# EAGLE design Adafruit Feather RP4020 rev B (EAGLE 9.6.2)
COMPANY: ADAFRUIT INDUSTRIES; DRAWN: KTOWN; REV: B
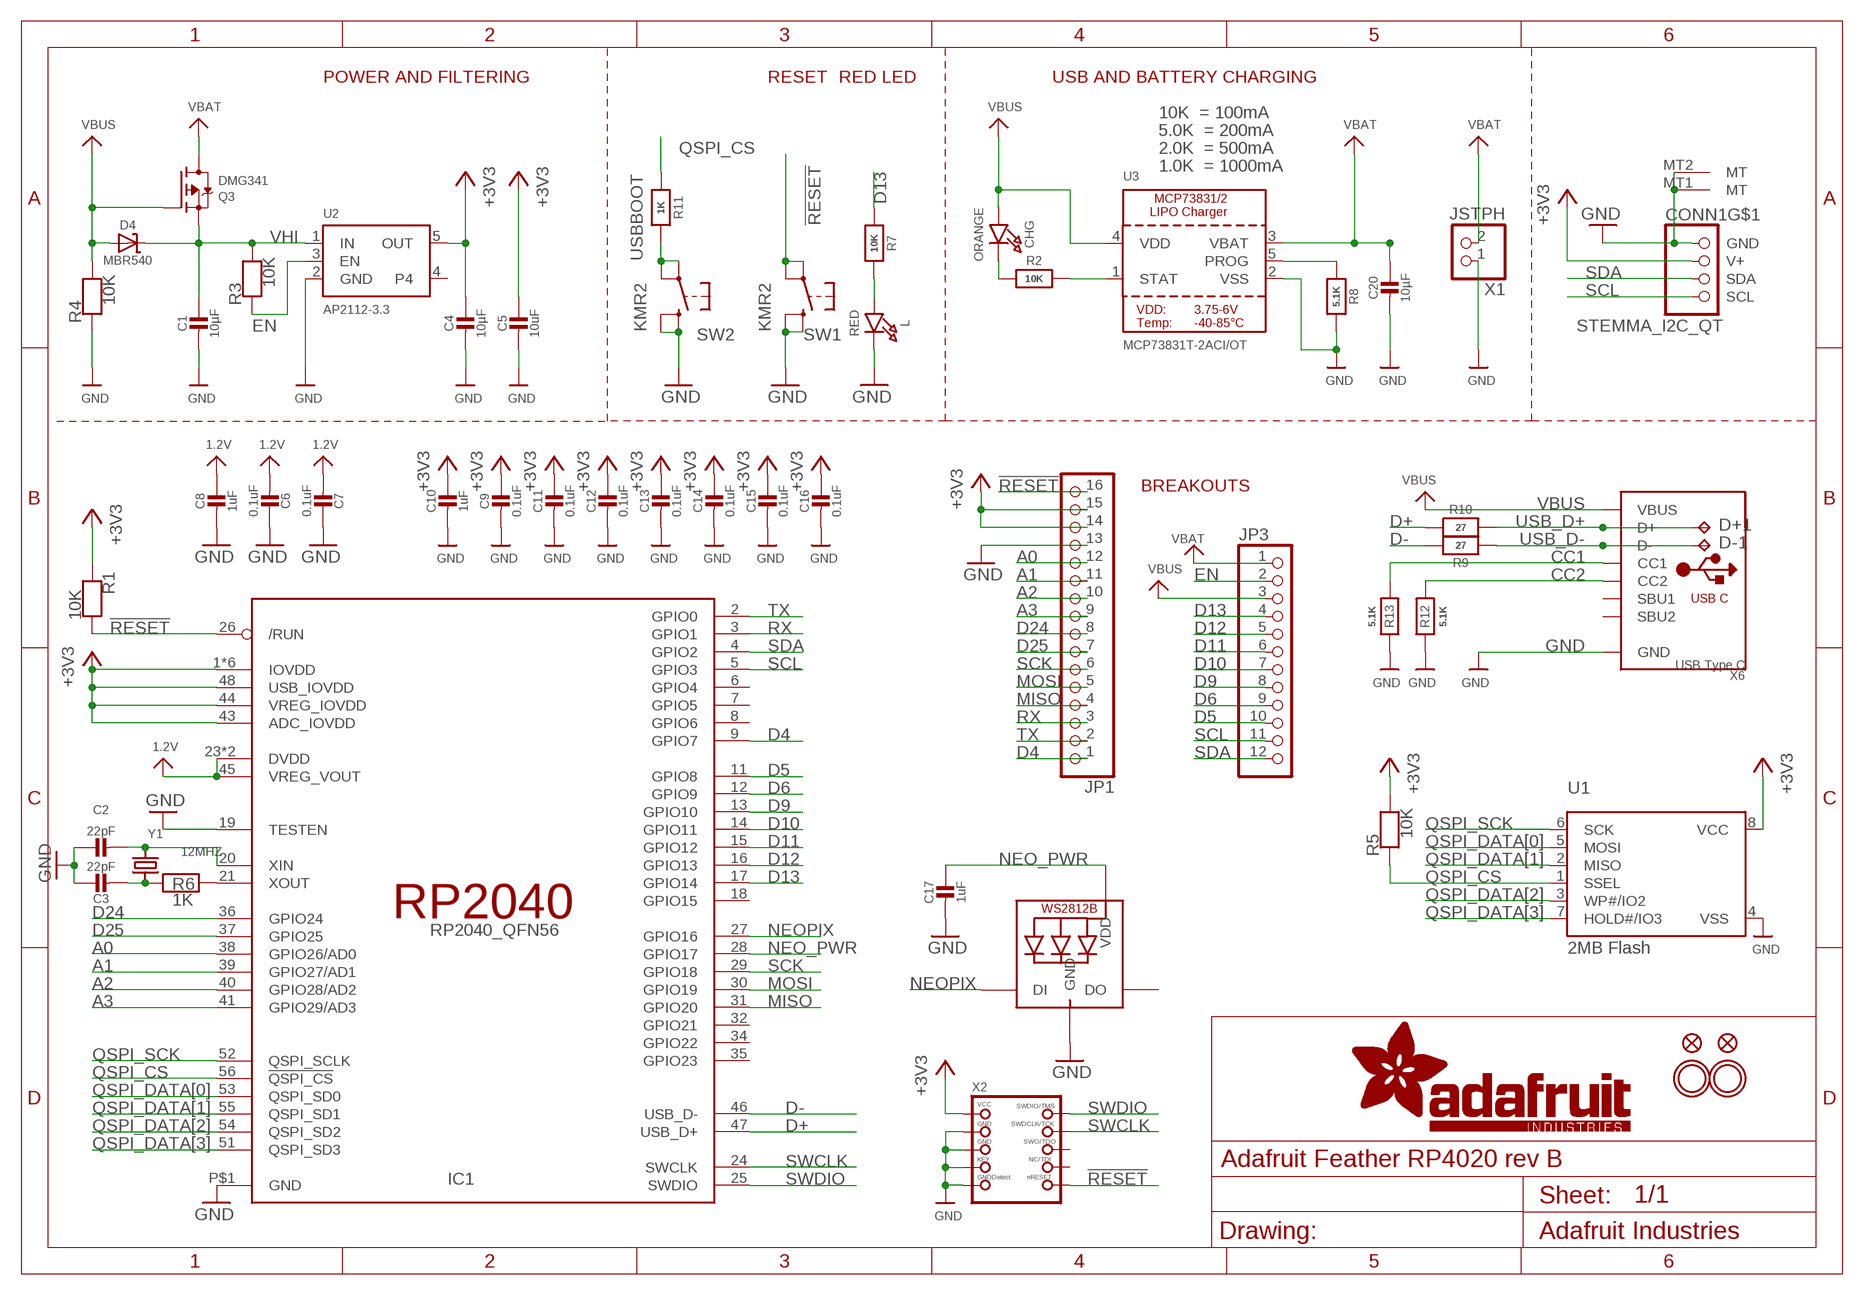
[diagram p0: schematic, sheet 1]

## Parts
C1  10µF  CAP_CERAMIC0805-NOOUTLINE  [0805-NO]
C2  22pF  CAP_CERAMIC0603_NO  [0603-NO]
C3  22pF  CAP_CERAMIC0603_NO  [0603-NO]
C4  10µF  CAP_CERAMIC0805-NOOUTLINE  [0805-NO]
C5  10uF  CAP_CERAMIC0805-NOOUTLINE  [0805-NO]
C6  0.1uF  CAP_CERAMIC0603_NO  [0603-NO]
C7  0.1uF  CAP_CERAMIC0603_NO  [0603-NO]
C8  1uF  CAP_CERAMIC0603_NO  [0603-NO]
C9  0.1uF  CAP_CERAMIC0603_NO  [0603-NO]
C10  1uF  CAP_CERAMIC0603_NO  [0603-NO]
C11  0.1uF  CAP_CERAMIC0603_NO  [0603-NO]
C12  0.1uF  CAP_CERAMIC0603_NO  [0603-NO]
C13  0.1uF  CAP_CERAMIC0603_NO  [0603-NO]
C14  0.1uF  CAP_CERAMIC0603_NO  [0603-NO]
C15  0.1uF  CAP_CERAMIC0603_NO  [0603-NO]
C16  0.1uF  CAP_CERAMIC0603_NO  [0603-NO]
C17  1uF  CAP_CERAMIC0603_NO  [0603-NO]
C20  10µF  CAP_CERAMIC0805-NOOUTLINE  [0805-NO]
CHG  ORANGE  LED0603_NOOUTLINE  [CHIPLED_0603_NOOUTLINE]
CONN1  STEMMA_I2C_QT  [JST_SH4]
D4  MBR540  DIODE-SCHOTTKYSOD-123  [SOD-123]
D+1  TPB1,27  [B1,27]
D-1  TPB1,27  [B1,27]
IC1  RP2040_QFN56  [QFN56_7MM_REDUCEDEPAD]
JP1  HEADER-1X16ROUND  [1X16_ROUND]
JP3  HEADER-1X12  [1X12_ROUND]
L  RED  LED0603_NOOUTLINE  [CHIPLED_0603_NOOUTLINE]
LED1  WS2812B3535  [LED3535]
Q3  DMG341  MOSFET-P  [SOT23-R]
R1  10K  RESISTOR_0603_NOOUT  [0603-NO]
R2  10K  RESISTOR_0603_NOOUT  [0603-NO]
R3  10K  RESISTOR_0603_NOOUT  [0603-NO]
R4  10K  RESISTOR_0603_NOOUT  [0603-NO]
R5  10K  RESISTOR_0603_NOOUT  [0603-NO]
R6  1K  RESISTOR_0603_NOOUT  [0603-NO]
R7  10K  RESISTOR_0603_NOOUT  [0603-NO]
R8  5.1K  RESISTOR_0603_NOOUT  [0603-NO]
R9  27  RESISTOR_0603_NOOUT  [0603-NO]
R10  27  RESISTOR_0603_NOOUT  [0603-NO]
R11  1K  RESISTOR_0603_NOOUT  [0603-NO]
R12  5.1K  RESISTOR_0603_NOOUT  [0603-NO]
R13  5.1K  RESISTOR_0603_NOOUT  [0603-NO]
SW1  KMR2  SWITCH_TACT_SMT4.6X2.8  [BTN_KMR2_4.6X2.8]
SW2  KMR2  SWITCH_TACT_SMT4.6X2.8  [BTN_KMR2_4.6X2.8]
U1  2MB Flash  SPIFLASH_8PIN208MIL  [SOIC8_208MIL]
U2  AP2112-3.3  VREG_SOT23-5  [SOT23-5@1]
U3  MCP73831T-2ACI/OT  MCP73831/2  [SOT23-5]
U$31  MOUNTINGHOLE2.5  [MOUNTINGHOLE_2.5_PLATED]
U$32  MOUNTINGHOLE2.5  [MOUNTINGHOLE_2.5_PLATED]
U$34  FIDUCIAL_1MM  [FIDUCIAL_1MM]
U$35  FIDUCIAL_1MM  [FIDUCIAL_1MM]
X1  JSTPH  CON_JST_PH_2PIN_BATT  [JSTPH2_BATT]
X2  JTAG-CORTEXBOXPOSTS  [2X05_1.27MM_BOX_POSTS]
X6  USB Type C  USB_C  [USB_C_CUSB31-CFM2AX-01-X]
Y1  12MHZ  CRYSTAL2.5X2.0  [CRYSTAL_2.5X2]

## Nets
1.2V: C6.2 C7.2 C8.1 IC1.23(DVDD) IC1.45(VREG_VOUT) IC1.50(DVDD)
!RESET: IC1.26(/RUN) JP1.16 R1.2 SW1.A'(P1) SW1.A(P) X2.10(NRESET)
+3V3: C4.1 C5.1 C9.1 C10.1 C11.1 C12.1 C13.1 C14.1 C15.1 C16.1 CONN1.2(V+) IC1.1(IOVDD) IC1.10(IOVDD) IC1.22(IOVDD) IC1.33(IOVDD) IC1.42(IOVDD) IC1.43(ADC_IOVDD) IC1.44(VREG_IOVDD) IC1.48(USB_IOVDD) IC1.49(IOVDD) JP1.14 JP1.15 R1.1 R5.2 U1.8(VCC) U2.5(OUT) X2.1(VCC)
A0: IC1.38(GPIO26/AD0) JP1.12
A1: IC1.39(GPIO27/AD1) JP1.11
A2: IC1.40(GPIO28/AD2) JP1.10
A3: IC1.41(GPIO29/AD3) JP1.9
CC1: R13.2 X6.A5(CC1)
CC2: R12.2 X6.B5(CC2)
D4: IC1.9(GPIO7) JP1.1
D5: IC1.11(GPIO8) JP3.10
D6: IC1.12(GPIO9) JP3.9
D9: IC1.13(GPIO10) JP3.8
D10: IC1.14(GPIO11) JP3.7
D11: IC1.15(GPIO12) JP3.6
D12: IC1.16(GPIO13) JP3.5
D13: IC1.17(GPIO14) JP3.4 R7.1
D24: IC1.36(GPIO24) JP1.8
D25: IC1.37(GPIO25) JP1.7
D+: IC1.47(USB_D+) R10.2
D-: IC1.46(USB_D-) R9.2
EN: JP3.2 R3.1 U2.3(EN)
GND [power]: C1.2 C2.1 C3.1 C4.2 C5.2 C6.1 C7.1 C8.2 C9.2 C10.2 C11.2 C12.2 C13.2 C14.2 C15.2 C16.2 C17.2 C20.2 CONN1.1(GND) CONN1.MT1(MT) CONN1.MT2(MT) IC1.19(TESTEN) IC1.P$1(GND) JP1.13 L.C LED1.4(GND) R4.1 R8.2 R12.1 R13.1 SW1.B'(S1) SW1.B(S) SW2.B'(S1) SW2.B(S) U1.4(VSS) U2.2(GND) U3.2(VSS) X1.1 X2.3(GND) X2.5(GND) X2.7(KEY) X2.9(GNDDETECT) X6.A1B12(GND) X6.B1A12(GND)
MISO: IC1.31(GPIO20) JP1.4
MOSI: IC1.30(GPIO19) JP1.5
N$1: CHG.C R2.1
N$2: L.A R7.2
N$3: R2.2 U3.1(STAT)
N$4: R8.1 U3.5(PROG)
N$5: C2.2 IC1.20(XIN) Y1.3
N$6: C3.2 R6.1 Y1.1
N$7: IC1.21(XOUT) R6.2
NEO_PWR: C17.1 IC1.28(GPIO17) LED1.2(VDD)
NEOPIX: IC1.27(GPIO16) LED1.1(DI)
QSPI_CS: IC1.56(!QSPI_CS) R5.1 R11.1 U1.1(SSEL)
QSPI_DATA[0]: IC1.53(QSPI_SD0) U1.5(MOSI)
QSPI_DATA[1]: IC1.55(QSPI_SD1) U1.2(MISO)
QSPI_DATA[2]: IC1.54(QSPI_SD2) U1.3(WP#/IO2)
QSPI_DATA[3]: IC1.51(QSPI_SD3) U1.7(HOLD#/IO3)
QSPI_SCK: IC1.52(QSPI_SCLK) U1.6(SCK)
RX: IC1.3(GPIO1) JP1.3
SCK: IC1.29(GPIO18) JP1.6
SCL: CONN1.4(SCL) IC1.5(GPIO3) JP3.11
SDA: CONN1.3(SDA) IC1.4(GPIO2) JP3.12
SWCLK: IC1.24(SWCLK) X2.4(SWDCLK)
SWDIO: IC1.25(SWDIO) X2.2(SWDIO)
TX: IC1.2(GPIO0) JP1.2
USB_D+: D+1.TP R10.1 X6.A6(D+) X6.B6(D+)
USB_D-: D-1.TP R9.1 X6.A7(D-) X6.B7(D-)
USBBOOT: R11.2 SW2.A'(P1) SW2.A(P)
VBAT [power]: C20.1 JP3.1 Q3.3(D) U3.3(VBAT) X1.2
VBUS [power]: CHG.A D4.A JP3.3 Q3.1(G) R4.2 U3.4(VDD) X6.A4B9(VBUS) X6.B4A9(VBUS)
VHI [power]: C1.1 D4.C Q3.2(S) R3.2 U2.1(IN)
Unconnected: IC1.6(GPIO4) IC1.7(GPIO5) IC1.8(GPIO6) IC1.18(GPIO15) IC1.32(GPIO21) IC1.34(GPIO22) IC1.35(GPIO23) LED1.3(DO) U2.4 X2.6(SWO) X2.8(TDI) X6.A8(SBU1) X6.B8(SBU2)

## Notes on the sheet
- POWER AND FILTERING | RESET | RED LED | USB AND BATTERY CHARGING
- 10K  = 100mA
- 5.0K  = 200mA
- 2.0K  = 500mA
- 1.0K  = 1000mA
- BREAKOUTS

## Library data of the parts
C1-C3 C5-C17 C20 = microbuilder:CAP_CERAMIC: Ceramic Capacitors For new designs, use the packages preceded by an '_' character since they are more reliable: The following footprints should be used on most boards: _0402 - Standard footprint for regular board layouts _0603 - Standard footprint for regular board layouts _0805 - Standard footprint for regular board layouts _1206 - Standard footprint for regular board layouts For extremely tight-pitch boards where space is at a premium, the following 'micro-pitch' footprints can be used (smaller pads, no silkscreen outline, etc.): _0402MP - Micro-pitch footprint for very dense/compact boards _0603MP - Micro-pitch footprint for very dense/compact boards _0805MP - Micro-pitch footprint for very dense/compact boards _1206MP - Micro-pitch footprint for very dense/compact boards
C4 = microbuilder:CAP_CERAMIC: Ceramic Capacitors For new designs, use the packages preceded by an '_' character since they are more reliable: The following footprints should be used on most boards: _0402 - Standard footprint for regular board layouts _0603 - Standard footprint for regular board layouts _0805 - Standard footprint for regular board layouts _1206 - Standard footprint for regular board layouts For extremely tight-pitch boards where space is at a premium, the following 'micro-pitch' footprints can be used (smaller pads, no silkscreen outline, etc.): _0402MP - Micro-pitch footprint for very dense/compact boards _0603MP - Micro-pitch footprint for very dense/compact boards _0805MP - Micro-pitch footprint for very dense/compact boards _1206MP - Micro-pitch footprint for very dense/compact boards; REV: A
CHG L = microbuilder:LED: LED 0603 - 0603 Surface Mount Package 2mA: Green LED - Low Power (3.9mcd, 2ma, 1.7Vf) - Digikey: 475-2709-2-ND Orange LED - Low Power (9.8mcd, 2ma, 1.8Vf) - Digikey: 475-1194-2-ND Red LED - Low Power (5mcd, 2ma, 1.8Vf) - Digikey: 475-1195-2-ND Yellow LED - Low Power (7mcd, 2ma, 1.8Vf) - Digikey: 475-1196-2-ND 5mA: Blue LED - Low Power (17mcd, 5ma, 2.9Vf) - Digikey: LNJ937W8CRACT-ND 0805 - 0805 Surface Mount Package 2mA: Red LED (8.8mcd, 2mA, 1.8Vf, Clear) - Low Power [Digikey: 475-2510-1-ND] Green LED (5mcd, 2mA, 1.8Vf, Clear) - Low Power [Digikey: 475-2730-1-ND] Yellow LED (11.3mcd, 2mA, 1.8Vf, Clear) - Low Power [Digikey: 475-2555-1-ND] 20mA: Red LED (104mcd, 20mA, Diffused) - LS R976 [Digikey: 475-1278-6-ND] Red LED (12mcd, 20mA, 2.0Vf, Clear) - APT2012EC [Digikey: 754-1128-1-ND] Green LED (15mcd, 20mA, 2.2Vf, Clear) - APT2012GC [Digikey: 754-1131-1-ND] Orange LED (160mcd, 20mA, 2.1Vf, Clear) - APT2012SECK [Digikey: 754-1130-1-ND] 1206 - 1206 Surface Mount Package Green LED (26mcd, 20mA, Diffused) - LG N971 [Digikey: 475-1407-6-ND] Red LED (15mcd, 20mA, Diffused) - LH N974 [Digikey: 475-1416-6-ND] Cree - Cree High-Power Surface Mount LEDs XPEBWT-L1-0000-00D50 - White 111lm 350mA 2.9Vf 6200K 110° XTEAWT-00-0000-00000LEE3 - White 114lm 350mA 2.85Vf 5000K 115° Everlight - Everlight 45-21 Series Surface Mount LEDs 45-21/QK2C-B2832AC2CB2/2T - Warm White 2000mcd 20mA 3.25Vf 3050K 120° 45-21/LK2C-B38452C4CB2/2T - Nuetral White 2000mcd 20mA 3.25Vf 4150K 120° 45-21/LK2C-B50634C6CB2/2T - Cold White 2200mcd 20mA 3.25Vf 5650K 120° PLCC2 Reverse Mount LS T77K-J1L2-1-0-2-R18-Z - Red 11.25mcd 2mA 1.8Vf 630nm 120° LO T77K-L1M2-24-Z - Orange 19.6mcd 2mA 1.8Vf 606nm 120° LY T77K-K2M1-26-Z - Yellow 15.7mcd 2mA 1.8Vf 587nm 120°
CONN1 = microbuilder:STEMMA_I2C
D4 = microbuilder:DIODE-SCHOTTKY
D+1 D-1 = testpad:TP: Test pad
IC1 = adafruit_micro:RP2040
JP1 = microbuilder:HEADER-1X16: PIN HEADER
JP3 = microbuilder:HEADER-1X12
LED1 = microbuilder:WS2812B
Q3 = microbuilder:MOSFET-P: P-Channel Mosfet LEGEND VDS: Voltage Drain-Source ID: Drain Current RDS(ON): Drain-Source On-State Resistance VGS(TH): Gate-Source Threshold Voltage CISS: Drain-Source Input Capacitance SOT-23 Name VDS ID RDS(ON) VGS(TH) CISS Order Number IRLML5103 30V 760mA 600 mOhm -- 75pF @ 25V Digikey: IRLML5103PBFCT-ND IRLML6401 12V 4.3A 50 mOhm 950mV @ 250µA 830pF @ 10V Digikey: IRLML6401PBFTR-ND NTR0202PL 20V 400mA 800 mOhm 2.3V @ 250uA 70pF @ 5V Digikey: NTR0202PLT1GOSTR-ND NTR4101PT1G 20V 1.8A 85 mOhm 1.2V @ 250uA 675pF @ 10V Digikey: NTR4101PT1GOSCT-ND DMP2004K 20V 600mA 900 mOhm 1V @ 250uA 175pF @ 16V Digikey: DMP2004KDICT-ND PMV65XP 20V 3.9A 76 mOhm 950mV @ 1mA 725pF @ 20V Digikey: 568-2358-2-ND TO-252 Name VDS ID RDS(ON) VGS(TH) CISS Order Number AOD417 30V 25A 34 mOhm 3V @ 250µA 920pF @ 15V Digikey: 785-1106-2-ND PowerPak Name VDS ID RDS(ON) VGS(TH) CISS Order Number AON7401 30V 12A 14 mOhm 3V @ 250µA 2600pF @ 15V Digikey: 785-1302-1-ND
R1-R13 = microbuilder:RESISTOR: Resistors For new designs, use the packages preceded by an '_' character since they are more reliable: The following footprints should be used on most boards: _0402 - Standard footprint for regular board layouts _0603 - Standard footprint for regular board layouts _0805 - Standard footprint for regular board layouts _1206 - Standard footprint for regular board layouts For extremely tight-pitch boards where space is at a premium, the following 'micro-pitch' footprints can be used (smaller pads, no silkscreen outline, etc.): _0402MP - Micro-pitch footprint for very dense/compact boards _0603MP - Micro-pitch footprint for very dense/compact boards _0805MP - Micro-pitch footprint for very dense/compact boards _1206MP - Micro-pitch footprint for very dense/compact boards
SW1 SW2 = microbuilder:SWITCH_TACT_SMT: SMT Tact Switches 6x6mm - Digikey: P12940SCT-ND KMR2 (4.6x2.8mm) - Digikey: 401-1426-1-ND EVQ-PQHB55 - Light Touch, 160GF (4.5x4.5mm) - Digikey: P8090SCT-ND KMT0 - KMT021 NGJ LHS (etc.) IP68/Waterproof - Digikey: CKN10289CT-ND
U1 = microbuilder:SPIFLASH_8PIN: SOIC8 SPI Flash Be careful with the size since SOIC8 flash comes in several 'widths' SOIC8 150 mil M25P16 - 16Mbit (2Mbit x 8) Serial Flash (75MHz SPI Bus), Supply: 2.7-3.6V Digikey: SOIC8 - M25P16-VMN6P-ND SOIC8 208 mil W25Q16BVSSIG - 16Mbit (2Mbit x 8) Serial Flash (104MHz SPI Bus), Supply: 2.7-3.6V Digikey: SOIC8 - W25Q16BVSSIG-ND
U2 = microbuilder:VREG_SOT23-5: SOT23-5 Fixed Voltage Regulators Part Current Out V Out V In V Dropout θJA (°C/W) TJ (°C) Digikey Part No. ADP121 150mA 3.3V 3.4-5.5V 0.09V @ 150mA -- -- ADP121-AUJZ33R7CT-ND ADP121 150mA 3.0V 3.1-5.5V 0.09V @ 150mA -- -- ADP121-AUJZ30R7CT-ND ADP122 300mA 3.3V 3.4-5.5V 0.085V @ 300mA -- -- ADP122AUJZ-3.3-R7CT-ND ADP1712 300mA 3.3V 3.5-5.5V 0.17V @ 300mA -- -- ADP1712AUJZ-3.3-R7TR-ND AP7311 (Low Cost) 150mA 3.3V 3.5-6V 0.15V @ 150mA -- -- AP7311-33WG-7DICT-ND LD39015M18R 150mA 1.8V 1.9V-5.5V 0.08V @ 100mA -- -- 497-6977-1-ND LP2985A-33DBVR 150mA 3.3V 3.3-16V 0.28V @ 150mA 206 150 296-18479-1-ND MCP1824T-3302E/OT 300mA 3.3V 3.5V-6V 0.2V @ 300mA -- -- MCP1824T-3302E/OTCT-ND MIC5205-2.5YM5 TR 150mA 2.5V 2.7-16V 0.165V @ 150mA -- -- 576-1257-2-ND MIC5205-3.0YM5 TR 150mA 3.0V 3.2V-16V 0.165V @ 150mA -- -- 576-1258-2-ND MIC5205-3.3YM5 TR 150mA 3.3V 3.5V-16V 0.165V @ 150mA -- -- 576-1259-2-ND TPS780330220 150mA 3.3V+2.2V 3.6-5.5V 250mV Max -- -- 296-23332-1-ND TDA3663/N1,135 100mA 3.3V 3.5-45V 0.18V @ 50mA -- -- 568-5343-1-ND Max operating temp can be calculated using θJA, TJ (max junction temperature), and power in watts. Set the "Maximum Ambient Temperature" until it reaches TJ ("Max Junction Temperature"), which is the absolute limit for safe use of the regulator: Heat Sink Temperature Calculator <http://www.daycounter.com/Calculators/Heat-Sink-Temperature-Calculator.phtml> For example, With 12V source into a 3.3V LP2985 and a 30mA load, we are dissipating (12V-3.3V) * 0.03A = 0.261W. With a θJA of 206 °C/W, a TJ of 150°C, and 261mW we can safely use the chip without a heat sink up to 75°C (=147.1°C Junction Temperature).
U3 = microbuilder:MCP73831/2: MCP73831/2 LIPO Charger VDD: 3.75 - 6V Temp -40 - 85°C Programmable Charge Rate: 15-500mA NOTE: STAT is a tri-state logic output on the MCP73831 and an open-drain output on the MCP73832. SOT23-5 with 4.2V output and tri-state logic on STAT = MCP73831T-2ACI/OT
U$31 U$32 = microbuilder:MOUNTINGHOLE: Mounting Hole For #2 screws (0.086"/2.18mm width, 0.094"/2.4mm hole) use 2.5mm; BOM: EXCLUDE
U$34 U$35 = microbuilder:FIDUCIAL: Fiducial Alignment Points Various fiducial points for machine vision alignment.; BOM: EXCLUDE
X1 = microbuilder:CON_JST_PH_2PIN: JST 2-Pin Right-Angle Connector PH-Series - 4UConnector: 17311 SH-Series - 4UConnector: 07278
X2 = microbuilder:JTAG-CORTEX: Serial Wire (SW-DP) Connector Standard 0.05" 10-pin connector is for use with the Cortex M and Cortex A SWD (serial wire debugger) interface (SW-DP) Connectors 2x05_1.27MM_SMT - Inexpensive surface-mount header with bare pins, compatible with standard 10-pin SWD cables (4UCON: 16846) 2x05_1.27MM_BOX_NOPOSTS - Polarised surface-mount box (4UCON with caps: 19735, without caps: 15117 2x05_1.27MM_BOX_POSTS - Polarised surface-mount box with mounting holes (4UCON: 20317) Pinout: http://infocenter.arm.com/help/topic/com.arm.doc.faqs/attached/13634/cortex_debug_connectors.pdf http://www.keil.com/peripherals/coresight/connectors.asp
X6 = microbuilder:USB_C: USB Type-C USB 2.0 Connector
Y1 = microbuilder:CRYSTAL: Crystals HC49UP - Surface Mount Crystal 4.0MHz 18pF +/-30ppm Surface Mount Crystal [Digikey: 535-9857-1-ND] 12.0 MHz Surface Mount Crystal [Digikey: 535-9869-6-ND] 25.0 MHz Surface Mount Crystal [Digikey: 535-9078-1-ND] 2.5 x 2.0mm - MEMs SMT Crystal 16.0 MHz 10pF 20ppm 2.5 x 2.0mm Crystal [Digikey -40-85°C: 535-10923-1-ND] 3.2 x 2.5mm - MEMs SMT Crystal 12.0 MHz 8pF 15ppm 3.2 x 2.5mm Crystal [Digikey: -10-70°C: 644-1047-1-ND -40-125°C: 644-1128-1-ND] 40~85°C cheaper: 644-1173-6-ND 16.0 MHz 8pF 15ppm 3.2 x 2.5mm Crystal [Digikey: -10-70°C: 644-1049-1-ND -40-125°C: 644-1129-2-ND]-40~85°C cheaper: 644-1175-6-ND 16.0 MHz 10pF 10ppm 3.2 x 2.5mm Crystal [Digikey: 644-1100-1-ND] 27.12 MHz 18pF 30ppm 3.2 x 2.5mm Crystal [Digikey: 887-1424-1-ND] 27.12MHz 10pF 10ppm 3.2 x 2.5mm Crystal [Digikey: 887-1329-1-ND] 4.9 x 1.8mm - MEMs SMT Crystal 32.768 KHz 12.5pF 20ppm 4.9 x 1.8mm Crystal [Digikey: SE2415CT-ND] 8.0 x 3.8mm - Surface Mount Crystal 32.768kHz 12.5pF 20ppm -40°C-85°C [Digikey: 535-9166-2-ND] Cylinder 32.768KHz Cylinder Crystal (2x6mm body) [Ex. Digikey: 300-8341-2-ND]

## Net classes
1 power: width 0.305 mm
2 gnd: width 0.254 mm

## Board
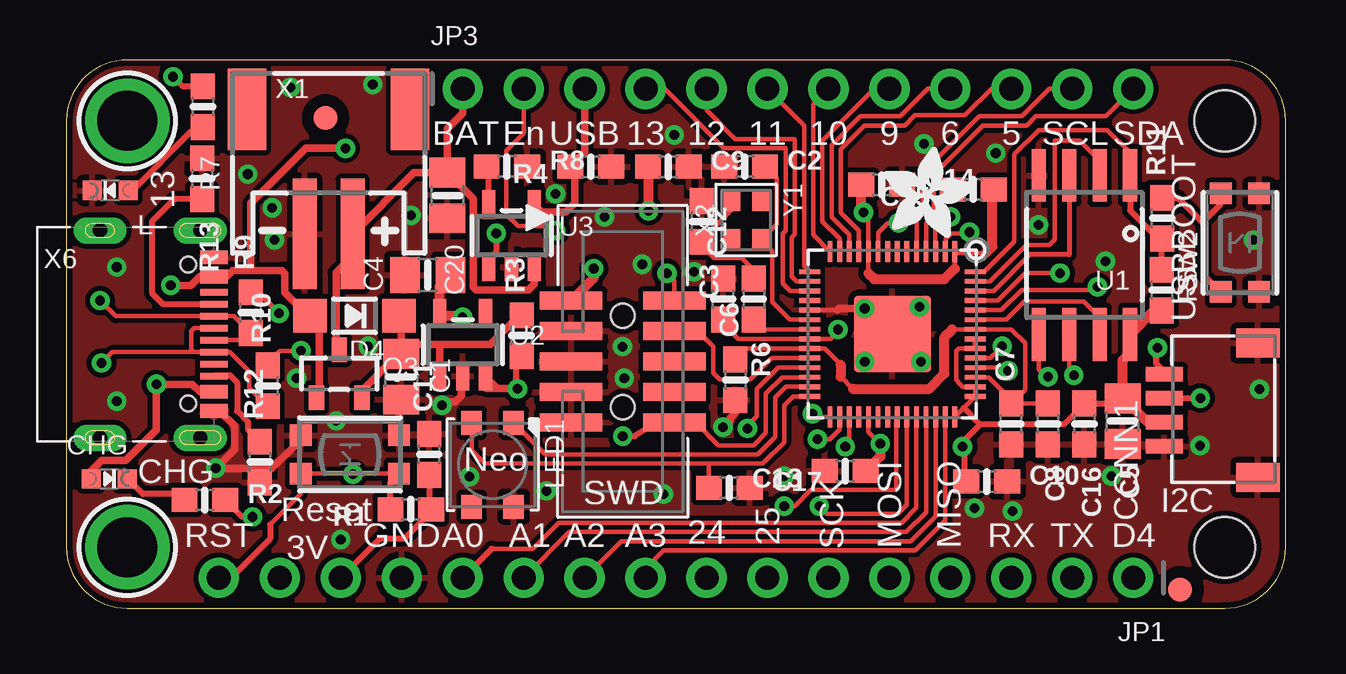
[diagram p1: board, top side]
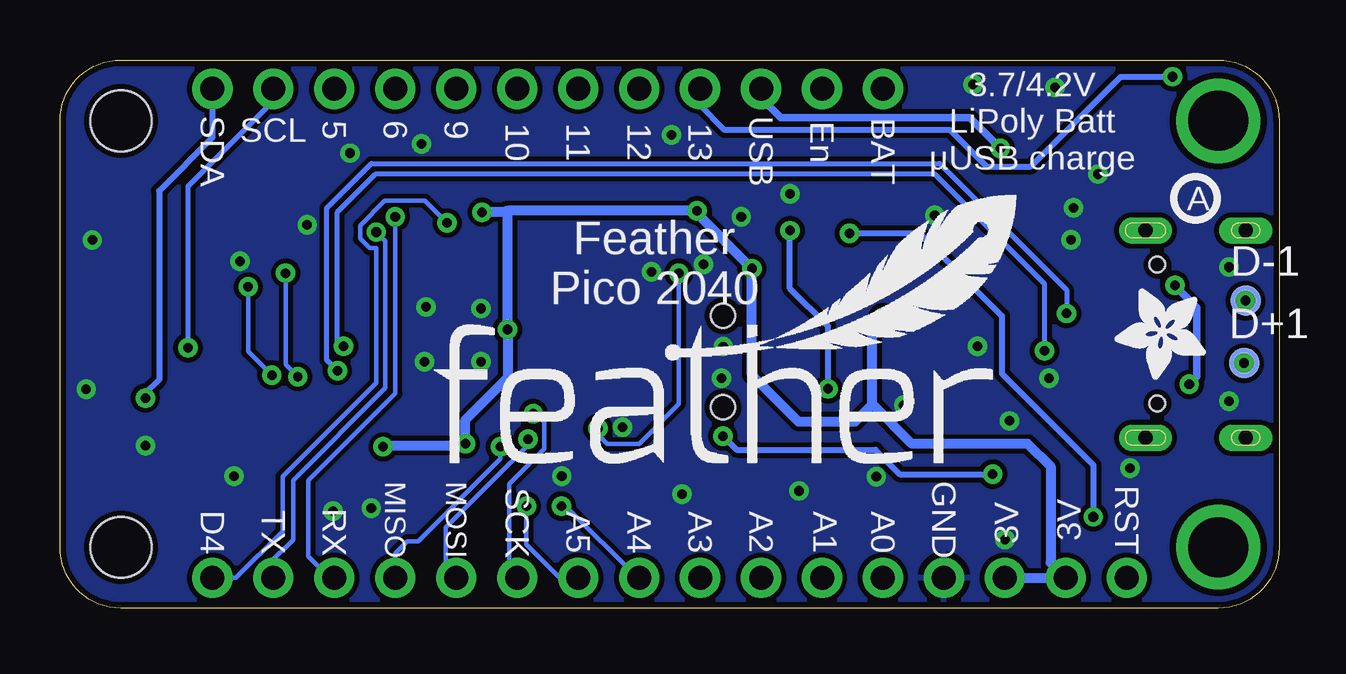
[diagram p2: board, bottom side, seen from below]

Size 50.8 x 22.86 mm. Coordinates in mm from the lower left corner, seen from the top.
Outline: 2.54,0 48.26,0 arc90 50.8,2.54 50.8,20.32 arc90 48.26,22.86 2.54,22.86 arc90 0,20.32 0,2.54 arc90 2.54,0
Copper layers (1*16): Top 0.035mm / dielectric 1.5mm / Bottom 0.035mm
Design rules "adafruit 7-7 *": minimum track width 7mil, minimum drill 15.5mil, track to track 8mil, track to pad 7mil, pad to pad 7mil, via to via 7mil, smd to smd 7mil, copper to edge 10mil, drill to drill 8mil, minimum pad ring 10mil, minimum via ring 8mil, stop-mask expansion 2mil, vias tented up to drill 20mil, thermal gap 10mil
Holes 2.54 mm at 48.26,20.32 48.26,2.54

### Footprints (pad centres in the part's own frame; a part is rotated, then mirrored left to right if it is on the bottom)
0805-NO = smd 1.24 x 1.5: 1 -0.95,0; 2 0.95,0
0603-NO = smd 1.075 x 1: 1 -0.85,0; 2 0.85,0
CHIPLED_0603_NOOUTLINE = smd 0.8 x 0.8: A 0,-0.75; C 0,0.75
JST_SH4 = smd 0.6 x 1.55: 1 -1.5,2.514; 2 -0.5,2.514; 3 0.5,2.514; 4 1.5,2.514 | smd 1.2 x 1.8: MT1 -2.8,-1.386; MT2 2.8,-1.386
SOD-123 = smd 1.4 x 1.4: A 1.85,0; C -1.85,0
B1,27 = smd 1.27 x 1.27: TP 0,0
QFN56_7MM_REDUCEDEPAD = smd 0.875 x 0.2: 1 -3.45,2.6; 2 -3.45,2.2; 3 -3.45,1.8; 4 -3.45,1.4; 5 -3.45,1; 6 -3.45,0.6; 7 -3.45,0.2; 8 -3.45,-0.2; 9 -3.45,-0.6; 10 -3.45,-1; 11 -3.45,-1.4; 12 -3.45,-1.8; 13 -3.45,-2.2; 14 -3.45,-2.6; 29 3.45,-2.6; 30 3.45,-2.2; 31 3.45,-1.8; 32 3.45,-1.4; 33 3.45,-1; 34 3.45,-0.6; 35 3.45,-0.2; 36 3.45,0.2; 37 3.45,0.6; 38 3.45,1; 39 3.45,1.4; 40 3.45,1.8; 41 3.45,2.2; 42 3.45,2.6 | smd 0.2 x 0.875: 15 -2.6,-3.45; 16 -2.2,-3.45; 17 -1.8,-3.45; 18 -1.4,-3.45; 19 -1,-3.45; 20 -0.6,-3.45; 21 -0.2,-3.45; 22 0.2,-3.45; 23 0.6,-3.45; 24 1,-3.45; 25 1.4,-3.45; 26 1.8,-3.45; 27 2.2,-3.45; 28 2.6,-3.45; 43 2.6,3.45; 44 2.2,3.45; 45 1.8,3.45; 46 1.4,3.45; 47 1,3.45; 48 0.6,3.45; 49 0.2,3.45; 50 -0.2,3.45; 51 -0.6,3.45; 52 -1,3.45; 53 -1.4,3.45; 54 -1.8,3.45; 55 -2.2,3.45; 56 -2.6,3.45 | smd 3.2 x 3.2: P$1 0,0
1X16_ROUND = drill 1 pad 1.676: 1 -19.05,0; 2 -16.51,0; 3 -13.97,0; 4 -11.43,0; 5 -8.89,0; 6 -6.35,0; 7 -3.81,0; 8 -1.27,0; 9 1.27,0; 10 3.81,0; 11 6.35,0; 12 8.89,0; 13 11.43,0; 14 13.97,0; 15 16.51,0; 16 19.05,0
1X12_ROUND = drill 1 pad 1.676: 1 -13.97,0; 2 -11.43,0; 3 -8.89,0; 4 -6.35,0; 5 -3.81,0; 6 -1.27,0; 7 1.27,0; 8 3.81,0; 9 6.35,0; 10 8.89,0; 11 11.43,0; 12 13.97,0
LED3535 = smd 1 x 0.85: 1 -1.75,0.875; 2 -1.75,-0.875; 3 1.75,-0.875; 4 1.75,0.875
SOT23-R = smd 0.635 x 1.016: 1 -0.95,-1; 2 0.95,-1; 3 0,1
BTN_KMR2_4.6X2.8 = smd 0.9 x 0.9: A 2.05,0.8; A' -2.05,0.8; B 2.05,-0.8; B' -2.05,-0.8
SOIC8_208MIL = smd 0.6 x 2.2: 1 -1.905,-3.315; 2 -0.635,-3.315; 3 0.635,-3.315; 4 1.905,-3.315; 5 1.905,3.315; 6 0.635,3.315; 7 -0.635,3.315; 8 -1.905,3.315
SOT23-5@1 = smd 0.55 x 1.2: 1 -0.95,-1.3; 2 0,-1.3; 3 0.95,-1.3; 4 0.95,1.3; 5 -0.95,1.3
SOT23-5 = smd 0.55 x 1.2: 1 -0.95,-1.3; 2 0,-1.3; 3 0.95,-1.3; 4 0.95,1.3; 5 -0.95,1.3
MOUNTINGHOLE_2.5_PLATED = drill 2.5 pad 3.2: P$1 0,0
FIDUCIAL_1MM = smd 1 x 1: 1 0,0
JSTPH2_BATT = smd 1 x 4.6: 1 -1,-3.7; 2 1,-3.7 | smd 1.6 x 3.4: NC1 -3.4,1.5; NC2 3.4,1.5
2X05_1.27MM_BOX_POSTS = smd 0.76 x 2.6: 1 -2.54,-2.15; 2 -2.54,2.15; 3 -1.27,-2.15; 4 -1.27,2.15; 5 0,-2.15; 6 0,2.15; 7 1.27,-2.15; 8 1.27,2.15; 9 2.54,-2.15; 10 2.54,2.15 | hole 1: -1.905,0; 1.905,0
USB_C_CUSB31-CFM2AX-01-X = smd 0.575 x 1.15: A1B12 -3.2,3.545; A4B9 -2.4,3.545; B1A12 3.2,3.545; B4A9 2.4,3.545 | smd 0.275 x 1.15: A5 -1.25,3.545; A6 -0.25,3.545; A7 0.25,3.545; A8 1.25,3.545; B5 1.75,3.545; B6 0.75,3.545; B7 -0.75,3.545; B8 -1.75,3.545 | drill 0.6 pad 1 long: M1 -4.32,2.97; M2 4.32,2.97; M3 -4.32,-1.21; M4 4.32,-1.21 | hole 0.65: 2.89,2.47; -2.89,2.47
CRYSTAL_2.5X2 = smd 0.9 x 0.75: 1 -0.825,-0.625; 2 0.825,-0.625; 3 0.825,0.625; 4 -0.825,0.625

### Placement (x,y rotation side)
C1  13.95,9.65 270 top
C2  28.26,18.41 0 top
C3  26.48,16.13 270 top
C4  15.05,13.89 180 top
C5  44.01,7.8 270 top
C6  27.88,9.53 90 top
C7  39.37,7.68 90 top
C8  40.89,7.68 270 top
C9  25.08,18.4 0 top
C10  38.35,5.28 0 top
C11  15.11,6.41 90 top
C12  27.37,12.89 90 top
C13  32.45,5.71 180 top
C14  33.97,17.65 0 top
C15  37.78,17.46 180 top
C16  42.42,7.68 270 top
C17  27.62,5.02 0 top
C20  15.88,17.21 270 top
CHG  1.78,5.4 270 top
CONN1  48.26,8.26 90 top
D4  12,12.19 180 top
D+1  1.46,10.22 0 bottom
D-1  1.4,12.83 0 bottom
IC1  34.42,11.43 270 top
JP1  25.4,1.27 180 top
JP3  30.48,21.65 0 top
L  1.82,17.42 90 top
LED1  17.75,5.98 270 top
Q3  11.37,9.78 0 top
R1  14.35,4.13 180 top
R2  5.77,4.51 0 top
R3  18.96,11.37 90 top
R4  21.84,18.41 180 top
R5  45.64,13.26 270 top
R6  28.64,12.89 270 top
R7  5.69,20.9 270 top
R8  18.35,18.41 0 top
R9  7.68,12.32 90 top
R10  8.38,9.27 90 top
R11  45.66,16.26 90 top
R12  8.06,6.1 90 top
R13  5.65,17.91 270 top
SW1  11.81,6.41 180 top
SW2  48.9,15.24 90 top
U1  42.42,14.73 180 top
U2  16.51,10.99 0 top
U3  18.54,15.53 0 top
U$9  [FEATHERLOGO]  35.24,5.97 0 bottom
U$12  [ADAFRUIT_3.5MM]  3.05,13.34 180 bottom
U$13  [PCBFEAT-REV-040]  3.49,17.08 0 bottom
U$28  [ADAFRUIT_3.5MM]  34.04,15.43 0 top
U$31  2.54,20.32 270 top
U$32  2.54,2.54 270 top
U$34  10.79,20.45 270 top
U$35  46.4,0.77 270 top
X1  10.92,19.3 0 top
X2  23.18,10.29 270 top
X6  2.6,11.43 270 top
Y1  28.32,16.19 270 top

### Tracks (layer width: path | path; a pad name or v marks a point on that pad's centre or on a via)
1.2V
  Top 0.178: 36.9,11.63 IC1.50 39.36,11.63 39.94,11.05 39.94,9.11 39.45,8.62 | 32.26,9.65 32.77,9.14 | 32.26,10.16 31.59,10.83 IC1.23 28.33,10.83 C6.2 | 39.45,8.62 C7.2 C8.1 | IC1.45 38.44,9.63 39.45,8.62
  Top 0.406: 36.9,11.63 36.58,11.3 36.58,9.78 35.94,9.14 32.77,9.14 | 32.26,10.16 32.26,9.65
!RESET  (via drill 0.4)
  Top 0.178: 12.38,5.61 SW1.A 9.76,4.77 8.48,3.49 | 12.38,5.61 SW1.A' | v11.94,5.59 12.36,5.59 12.38,5.61 | X2.10 26.23,7.75 26.69,7.29 26.69,7.27 27.16,6.79 28.64,6.79 29.15,7.3 29.15,8.95 29.82,9.63 30.73,9.63 IC1.26 | IC1.26
  Top 0.254: JP1.16 6.86,1.27 8.48,2.9 8.48,3.49 | v23.18,7.18 23.68,7.18 24.64,7.77 24.69,7.75 X2.10 | R1.2 13.5,5.25 SW1.A'
  Bottom 0.254: v11.94,5.59 15.81,5.59 16.83,6.6 22.61,6.6 v23.18,7.18
+3V3  (via drill 0.4)
  Top 0.178: IC1.42 37.38,8.34 IC1.43 IC1.44 37.35,9.23 37.16,9.42 37.16,9.45 37.08,9.53 37.08,10.73 37.18,10.83 IC1.48 | IC1.33 33.42,7.35 v33.91,6.86 | 33.42,13.95 IC1.10 33.42,16.51 v33.21,16.51 | 37.02,14.16 IC1.1 37.08,14.82 38.31,14.82 | v32.15,11.62 32.15,11.53 31.86,11.23 IC1.22 27.99,11.23 27.37,11.85 C12.1 | C15.1 38.57,17.46 38.39,17.29
  Top 0.203: IC1.48 IC1.49
  Top 0.254: JP1.14 13.08,2.92 14.1,2.92 15.2,4.03 R1.1 15.11,4.21 C11.1 | 38.03,7.69 38.07,7.65 37.47,7.05 37.47,6.86 v37.34,6.73 37.4,6.67 37.4,5.5 C10.1 | 38.03,7.69 37.38,8.34 | 38.03,7.69 41.58,7.69 C16.1 43.79,8.53 C5.1
  Top 0.305: U2.5 15.65,12.19 | 16.45,12.19 v16.51,12.13 | 15.56,13.45 C4.1 | 24.23,16.6 v24.26,16.57
  Top 0.406: 16.45,12.19 15.65,12.19 | 33.42,13.95 33.66,13.72 36.58,13.72 37.02,14.16 | v33.21,16.51 33.12,16.6 C14.1 | v21.97,14.16 21.97,13.77 X2.1 | 38.31,14.82 38.58,15.08 38.58,17.1 38.39,17.29 | v33.91,6.86 33.91,6.33 C13.1 | CONN1.2 45.06,7.75 44.07,8.75 C5.1 44.01,10.34 44.26,10.59 44.26,11.35 U1.8 45.31,12.41 R5.2 | U2.5 15.56,13.45 | C9.1 24.23,16.6
  Bottom 0.178: 33.91,6.79 v33.91,6.86 | 32.15,16.57 32.19,16.57
  Bottom 0.305: 16.95,8.49 16.95,8.51
  Bottom 0.406: v16.51,12.13 16.95,11.68 16.95,8.51 15.3,6.86 10.48,6.86 9.53,5.91 9.53,1.91 JP1.15 JP1.14 | v37.34,6.73 37.27,6.79 33.91,6.79 | 32.19,16.57 32.26,16.51 v33.21,16.51 | v33.91,6.86 33.91,7.86 32.15,9.61 v32.15,11.62 32.15,16.57 v24.26,16.57 24.26,16.45 v21.97,14.16 21.97,9.72 20.03,7.78 17.67,7.78 16.95,8.49
A0
  Top 0.178: IC1.38 35.42,4.17 34.8,3.56 20.51,3.56 19.43,2.48 17.72,2.48
  Top 0.254: 17.72,2.48 JP1.12
A1
  Top 0.178: JP1.11 20.95,3.17 34.99,3.17 35.82,4 IC1.39
A2
  Top 0.178: IC1.40 36.22,3.83 35.18,2.79 23.11,2.79 JP1.10
A3
  Top 0.178: IC1.41 36.62,3.66 35.37,2.41 24.89,2.41 24.13,1.65 JP1.9
CC1
  Top 0.254: R13.2 4.48,17.06 3.56,16.13 3.56,13.14 4.02,12.68 X6.A5
CC2
  Top 0.254: X6.B5 6.18,9.71 6.82,9.71 7.11,9.42 7.11,8.22 7.56,7.77 7.56,7.45 R12.2
D4  (via drill 0.39)
  Top 0.178: IC1.9 33.82,15.05 33.82,15.66 34.23,16.07 v34.67,16.07 | IC1.9
  Bottom 0.178: v34.67,16.07 35.59,16.99 37.26,16.99 38.29,15.96 38.29,15.41 37.9,15.02 37.62,15.02 37.62,9.4 41.53,5.49 41.53,3.21 43.47,1.27 JP1.1
D5
  Top 0.178: JP3.10 38.54,21.65 37.44,20.55 35.34,20.55 34.92,20.13 33.24,20.13 32.26,19.15 32.26,16.5 33.02,15.75 33.02,15.74 IC1.11
D6
  Top 0.178: JP3.9 35.88,21.65 34.73,20.51 33.08,20.51 31.88,19.31 31.88,16.32 32.62,15.58 IC1.12
D9
  Top 0.178: JP3.8 33.66,21.65 31.5,19.5 31.5,16.13 32.19,15.43 32.22,15.41 IC1.13
D10
  Top 0.178: JP3.7 31.12,21.02 31.12,15.57 IC1.14
D11
  Top 0.178: JP3.6 30.74,20.13 30.74,14.26 IC1.15
D12
  Top 0.178: JP3.5 26.67,20.77 27.88,19.56 30.36,19.56 30.36,15.59 30.22,15.46 30.22,13.83 30.42,13.63 IC1.16
D13  (via drill 0.4)
  Top 0.178: JP3.4 24.93,21.65 27.4,19.18 29.97,19.18 29.97,15.75 29.84,15.62 29.84,13.54 30.15,13.23 IC1.17
  Top 0.254: R7.1 4.85,21.75 v4.45,22.16
  Bottom 0.254: v4.45,22.16 6.6,22.16 10.35,18.41 12.19,18.41 13.72,19.94 23.11,19.94 24.13,20.95 JP3.4
D24  (via drill 0.4)
  Top 0.178: IC1.36 34.58,7.95 34.58,4.92 31.02,4.92 30.35,4.25 v29.91,4.25
  Bottom 0.178: v29.91,4.25 29.72,4.25 26.73,1.27 JP1.8
D25  (via drill 0.4)
  Top 0.178: IC1.37 35.02,4.31 34.64,3.94 31.69,3.94 v31.37,4.25
  Bottom 0.178: JP1.7 29.97,1.27 31.37,2.67 31.37,4 v31.37,4.25
D+  (via drill 0.4)
  Top 0.178: v9.78,10.73 8.89,10.73 8.38,10.22 R10.2 | IC1.47 38.5,10.43 38.8,10.73 v38.99,10.92
  Bottom 0.203: v38.99,10.92 39.05,10.92 39.24,11.11 39.24,16.51 37.66,18.1 14.35,18.1 9.78,13.53 v9.78,10.73
D-  (via drill 0.4)
  Top 0.178: v39.24,9.91 39.12,10.03 IC1.46
  Top 0.203: v8.86,12.29 7.98,13.17 R9.2
  Bottom 0.203: v39.24,9.91 39.69,10.35 39.69,16.68 37.82,18.54 14.14,18.54 8.86,13.26 v8.86,12.29
EN  (via drill 0.4)
  Top 0.178: JP3.2 19.05,19.8 18.33,19.09 18.33,16.42 18.82,15.94 20.19,15.94 v20.38,15.75
  Top 0.254: R3.1 18.73,10.29 18.73,9.18 17.96,9.18 U2.3 17.46,9.14 v18.8,9.14
  Bottom 0.254: v18.8,9.14 18.8,11.75 20.38,13.34 v20.38,15.75
GND  (via drill 0.39, 0.4)
  Top 0.178: IC1.19 32.11,12.43
  Top 0.305: U2.2 16.45,9.62 16.45,8.86 16.19,8.61 15.65,8.61 v15.65,8.47 | SW1.B 9.76,7.02 8.56,5.82 6.22,5.82 7.01,6.61 7.01,7.59 6.38,8.23 X6.B1A12 | 32.11,12.43 32.18,12.5 v33.26,12.5 34.33,11.43 IC1.P$1 | C6.1 27.88,8.15 27.65,7.92 27.65,7.84 v27.36,7.54
  other vias: 11.24,7.81 23.24,9.59 14.35,16.38 8.57,16.7 6.22,5.84 9.33,21.72 12.76,21.84 12.57,10.92 7.56,18.1 16.79,5.49 8.67,15.35 25.32,19.74 26.15,14.02 23.99,14.34 23.16,10.91 24.88,4.75 35.55,12.56 35.61,10.27 33.26,10.27 35.74,19.35 43.29,14.47 37.83,4.18 49.71,9.13 47.23,6.78 43.55,5.51 22.42,16.32 20.38,17.27 38.72,18.97 9.59,9.59 2.1,8.64 2.1,14.22 20,4.89 11.43,2.86 49.45,15.35 39.42,4.05 29.9,5.51 40.5,15.99
  pour Top: 0,22.86 0,0 50.8,-0.06 50.8,22.86
  pour Bottom: 50.93,0 0,0 0,22.86 50.93,22.86
MISO  (via drill 0.4)
  Top 0.178: IC1.31 32.62,6.9 v32.45,6.73
  Bottom 0.178: v32.45,6.73 32.45,6.22 35.88,2.79 36.32,2.79 36.83,2.29 JP1.4
MOSI  (via drill 0.4)
  Top 0.178: IC1.30 32.22,7.46 31.81,7.05 v31.3,7.05
  Bottom 0.178: v31.3,7.05 31.3,6.8 34.73,3.37 34.73,1.52 34.48,1.27 JP1.5
N$1
  Top 0.254: R2.1 4.66,4.76 3.18,4.76 2.54,5.4 CHG.C
N$2
  Top 0.254: R7.2 5.52,19.89 5.2,19.89 2.74,17.42 L.A
N$3  (via drill 0.4)
  Top 0.254: v7.75,3.81 7.31,3.81 R2.2 | v17.91,15.63 17.91,14.84 17.59,14.53 U3.1
  Bottom 0.254: v7.75,3.81 7.75,5.97 11.56,9.78 11.56,12.19 15,15.63 v17.91,15.63
N$4
  Top 0.254: R8.1 17.57,18.35 17.57,16.86 U3.5
N$5
  Top 0.178: C2.2 29.59,17.93 29.59,16.01 Y1.3 29.41,14.9 29.41,12.76 30.14,12.03 IC1.20
N$6
  Top 0.178: Y1.1 27.7,16.59 26.48,15.37 C3.2 26.48,15.13 27,14.61 28.13,14.61 28.64,14.1 R6.1
N$7
  Top 0.178: IC1.21 29.05,11.63 R6.2
NEO_PWR
  Top 0.178: IC1.28 30.29,8.83 29.91,8.45 29.91,6.92 29.02,6.03 26.8,6.03 | LED1.2 16.88,6.58 17.43,6.03 26.8,6.03 | C17.1 26.77,6.01 26.8,6.03
NEOPIX
  Top 0.178: LED1.1 19.95,6.41 28.8,6.41 29.53,7.14 29.53,8.79 29.98,9.25 30.95,9.25 IC1.27
QSPI_CS
  Top 0.178: IC1.56 38.25,14.03 39.5,15.28 39.5,18.92 40.51,19.94 43.37,19.94 44.32,18.99 U1.1 44.32,16.95
  Top 0.254: R5.1 45.64,15.39 | 45.64,15.39 45.58,15.33 44.32,16.59 44.32,16.95 | 45.64,15.39 R11.1
QSPI_DATA[0]  (via drill 0.39)
  Top 0.178: IC1.53 38.8,12.83 39.94,13.97 v41.4,13.97 | v40.89,9.65 40.82,9.65 40.51,9.96 U1.5
  Bottom 0.178: v41.4,13.97 41.4,10.16 v40.89,9.65
QSPI_DATA[1]
  Top 0.178: 43.05,18.67 42.23,19.49 41.18,19.49 41.18,16.45 41.18,16.36 41.18,15.36 40.96,15.14 39.98,15.14 38.47,13.63 IC1.55
  Top 0.203: 43.05,18.67 U1.2
QSPI_DATA[2]
  Top 0.178: IC1.54 38.63,13.23 40.15,14.74
  Top 0.203: U1.3 41.78,14.74 40.15,14.74
QSPI_DATA[3]
  Top 0.178: IC1.51 39.16,12.03 39.91,12.78 42.4,12.78 43.05,12.13 U1.7
QSPI_SCK  (via drill 0.39)
  Top 0.178: IC1.52 38.95,12.43 39.8,13.27 42.83,13.27 v42.96,13.4 | v41.97,9.72 41.78,9.91 41.78,11.24 U1.6 | U1.6
  Bottom 0.178: v42.96,13.4 42.96,10.7 v41.97,9.72
RX  (via drill 0.4)
  Top 0.178: v36.83,16.32 36.62,16.32 36.2,15.89 36.2,14.9 IC1.3
  Bottom 0.178: JP1.3 39.56,1.27 40.45,2.16 40.45,5.33 36.83,8.95 v36.83,16.32
SCK  (via drill 0.4)
  Top 0.178: IC1.29 31.21,7.98 v31.08,8.11
  Bottom 0.178: v31.08,8.11 30.98,8.11 30.63,7.76 30.63,6.65 32.09,5.19 32.09,1.42 31.94,1.27 JP1.6
SCL  (via drill 0.4)
  Top 0.178: JP3.11 40.96,21.65 39.81,20.51 38.03,20.51 35.68,18.17 35.68,16.46 35.44,16.21 35.44,14.9 IC1.5
  Top 0.254: CONN1.4 45.81,9.82 45.41,10.21 45.4,10.79 v45.47,10.86
  Bottom 0.203: v45.47,10.86 45.47,17.59 41.91,21.14 JP3.11
SDA  (via drill 0.4)
  Top 0.178: JP3.12 43.31,20.51 40.39,20.51 40.01,20.13 38.19,20.13 36.13,18.07 36.13,16.36 35.82,16.05 IC1.4
  Top 0.254: v47.24,8.76 47.02,8.76 CONN1.3
  Bottom 0.254: JP3.12 44.45,19.62 46.67,17.4 46.67,9.53 47.24,8.95 v47.24,8.76
SWCLK
  Top 0.178: IC1.24 29.38,10.43 28.49,9.54 27.22,9.54 26.96,9.8 26.96,10.9 26.3,11.56 X2.4
SWDIO  (via drill 0.4)
  Top 0.178: X2.2 25.33,13.66 v25.02,13.97 | v28.38,7.49 28.38,7.62 28.77,8 28.77,9.14 29.65,10.03 30.73,10.03 IC1.25 | IC1.25
  Bottom 0.178: v28.38,7.49 28.38,7.24 28,6.86 26.67,6.86 25.02,8.51 v25.02,13.97
TX  (via drill 0.4)
  Top 0.178: IC1.2 36.64,14.9 36.64,15.41 36.84,15.62 37.56,15.62 v37.62,15.68
  Bottom 0.178: v37.62,15.68 37.24,15.3 37.24,9.18 41.08,5.33 41.08,2.86 42.1,1.84 42.1,1.4 41.97,1.27 JP1.2
USB_D+  (via drill 0.4)
  Top 0.178: 5.32,10.68 X6.B6 6.8,10.68 7.62,9.87 7.62,9.19 R10.1 | 5.32,10.68 5.21,10.79 5.21,11.56 5.33,11.68 X6.A6 | 5.32,10.68 1.92,10.68 D+1.TP
  other vias: 1.46,10.22
USB_D-  (via drill 0.4)
  Top 0.178: X6.A7 7.39,11.18 R9.1 6.97,12.18 X6.B7 2.04,12.18 D-1.TP
  other vias: 1.4,12.83
USBBOOT
  Top 0.254: SW2.A 48.09,16.85 47.37,16.13 47.37,16.07 | 47.37,16.07 47.37,13.91 SW2.A' | R11.2 46.33,17.11 47.37,16.07
VBAT
  Top 0.305: Q3.3 11.24,10.91 11.24,13.99 11.92,14.67 X1.2 14.48,18.16 C20.1 | JP3.1 16.51,20.64 15.88,20 C20.1 | C20.1 16.95,17.08 16.95,15.5 16.95,13.4 17.08,13.27 19.24,13.27 19.49,13.52 U3.3
VBUS  (via drill 0.4)
  Top 0.305: Q3.1 10.54,8.91 10.54,11.7 10.15,12.09 D4.A 10.06,12.19 10.06,12.2 9.09,13.17 9.09,13.96 8.97,14.09 7.68,14.09 | v4.34,13.46 5.19,13.46 5.56,13.83 X6.A4B9 6.68,13.83 6.93,14.09 7.68,14.09 | X6.B4A9 5.56,9.03 5.25,9.34 v3.75,9.34 3.75,7.43 2.48,6.16 1.47,6.16 1.03,5.71 CHG.A | v11.62,19.18 9.97,19.18 7.68,16.89 7.68,14.09 | JP3.3 21.59,19.01 R4.2 21.18,18.22 21.18,16.89 20.81,16.52 19.81,16.52 U3.4
  Bottom 0.305: v4.34,13.46 3.43,12.55 3.43,9.65 v3.75,9.34 | JP3.3 21.59,21.27 20.77,20.45 12.89,20.45 v11.62,19.18
VHI
  Top 0.305: 15.56,10.99 17.65,10.99 18.88,12.22 R3.2 | U2.1 15.56,10.99 | C1.1 13.84,10.6 12.32,9.08 Q3.2 | C1.1 13.95,12.1 D4.C | 15.56,10.99 14.34,10.99 C1.1

### Text on the board
tPlace: BAT | En | USB | 13 | 12 | 11 | 10 | 9 | 6 | 5 | SCL | SDA | 13 | USBBOOT | CHG | Neo | SWD | I2C | Reset | SCK | MOSI | MISO | RST | 3V | GND | A0 | A1 | A2 | A3 | 24 | 25 | RX | TX | D4
bPlace: 3.7/4.2V / LiPoly Batt / µUSB charge | 9 | 6 | 5 | SCL | BAT | En | USB | 13 | 12 | 11 | 10 | SDA | Feather / Pico 2040 | RST | 3V | 3V | GND | SCK | MOSI | MISO | A0 | A1 | A2 | A3 | A4 | A5 | RX | TX | D4